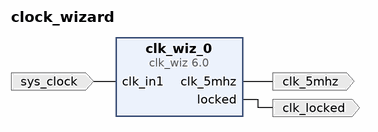
[diagram p0: block diagram of the top level]
# Vivado block design clock_wizard, xc7z020clg400-1, Vivado 2023.1
create_bd_design clock_wizard

create_bd_port -dir I -type clk sys_clock
set_property -dict {CONFIG.FREQ_HZ 125000000 CONFIG.PHASE 0.0} [get_bd_ports sys_clock]
create_bd_port -dir O clk_locked
create_bd_port -dir O -type clk clk_5mhz

create_bd_cell -type ip -vlnv xilinx.com:ip:clk_wiz:6.0 clk_wiz_0
set_property -dict [list \
  CONFIG.CLKIN1_JITTER_PS 80.0 \
  CONFIG.CLKOUT1_JITTER 529.616 \
  CONFIG.CLKOUT1_PHASE_ERROR 319.966 \
  CONFIG.CLKOUT1_REQUESTED_OUT_FREQ 5 \
  CONFIG.CLK_IN1_BOARD_INTERFACE sys_clock \
  CONFIG.CLK_OUT1_PORT clk_5mhz \
  CONFIG.MMCM_CLKFBOUT_MULT_F 25.500 \
  CONFIG.MMCM_CLKIN1_PERIOD 8.000 \
  CONFIG.MMCM_CLKIN2_PERIOD 10.0 \
  CONFIG.MMCM_CLKOUT0_DIVIDE_F 127.500 \
  CONFIG.MMCM_DIVCLK_DIVIDE 5 \
  CONFIG.USE_BOARD_FLOW true \
  CONFIG.USE_RESET false \
] [get_bd_cells clk_wiz_0]

# ---- connections ----

connect_bd_net [get_bd_pins clk_wiz_0/clk_5mhz] [get_bd_ports clk_5mhz]
connect_bd_net [get_bd_pins clk_wiz_0/locked] [get_bd_ports clk_locked]
connect_bd_net [get_bd_ports sys_clock] [get_bd_pins clk_wiz_0/clk_in1]

validate_bd_design
save_bd_design
